# Altium schematic sheet leds-logo.SchDoc
size A4
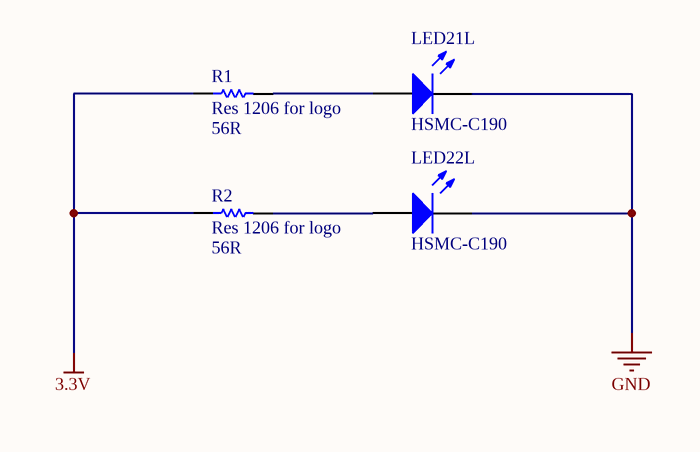
[diagram p0: leds-logo.SchDoc]

## Parts
LED21L  HSMC-C190  [1.6X0.8X0.8]
LED22L  HSMC-C190  [1.6X0.8X0.8]
R1  Res 1206 for logo  value 56R  [RESC1206(3216)_L]
R2  Res 1206 for logo  value 56R  [RESC1206(3216)_L]

## Nets
3.3V: R1.1 R2.1
GND: LED21L.2(K) LED22L.2(K)
NetLED21L_1: LED21L.1(A) R1.2
NetLED22L_1: LED22L.1(A) R2.2

## Library data of the parts
LED21L LED22L = HSMC-C190: High Performance Chip LED, Red; LuminousIntensity: 25mcd (Minimum).; PCB_Layout: Complies with manufacturer's recommendation.; Published: 11-Dec-2002; DatasheetVersion: 11-Mar-2002; PackageVersion: Mar-2002; PackageReference: 1.6X0.8X0.8; Publisher: Altium Limited; PackageDescription: SM LED; 2 Flat Leads; LED_Colour: Red; ComponentLink1Description: Manufacturer Link; ComponentLink1URL: http://www.avagotech.com/; ComponentLink2Description: Datasheet; ComponentLink2URL: http://cp.literature.agilent.com/litweb/pdf/5988-5891EN.pdf
R1 R2 = CMP-1014-00056-1: 180R 0.25W 5% 1206 (3216 Metric)  SMD; Case-Metric: 3216; Case-EIA: 1206; Technology: SMT; Tolerance: 5 %; Power: 0.25 W